# Altium schematic sheet Motor_Driver_Schematic_RevA.SchDoc
size A; SheetNumber: 1; SheetTotal: 1
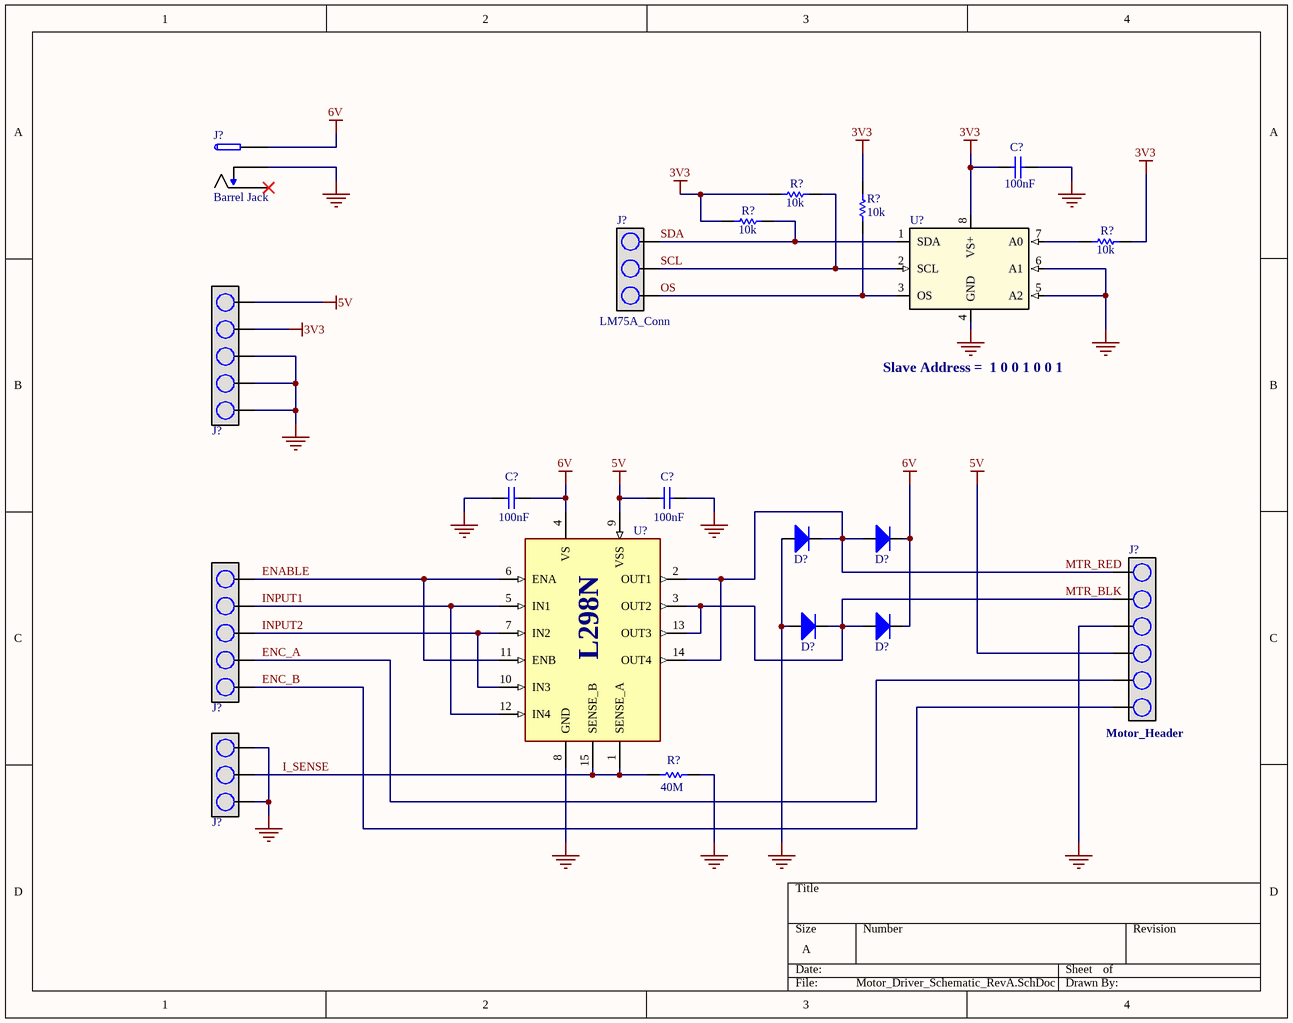
[diagram p0: Motor_Driver_Schematic_RevA.SchDoc]

## Parts
(Parts that share a designator on the sheet are numbered #1, #2 ... from top to bottom, then left to right.)
C?#1  Capacitance: 100nF  [CAP_1206]  (hidden comment: C1206C104K5RAC7800)
C?#2  Capacitance: 100nF  [CAP_1206]  (hidden comment: C1206C104K5RAC7800)
C?#3  Capacitance: 100nF  [CAP_1206]  (hidden comment: C1206C104K5RAC7800)
D?#1  RS2AA R3G  [RS2AA]  (value not drawn)
D?#2  RS2AA R3G  [RS2AA]  (value not drawn)
D?#3  RS2AA R3G  [RS2AA]  (value not drawn)
D?#4  RS2AA R3G  [RS2AA]  (value not drawn)
J?#1  Barrel Jack  [GRAVITECH_CON-SOCJ-2155]
J?#2  5 Pin 2.5mm Male Connector  (value not drawn)
J?#3  LM75A_Conn
J?#4  5 Pin 2.5mm Male Connector  (value not drawn)
J?#5  Motor_Header
J?#6  3 Pin 2.54mm Male Connector  (value not drawn)
R?#1  value 10k  [RES_1206]  (hidden comment: RC1206JR-0710KL)
R?#2  value 10k  [RES_1206]  (hidden comment: RC1206JR-0710KL)
R?#3  value 10k  [RES_1206]  (hidden comment: RC1206JR-0710KL)
R?#4  value 10k  [RES_1206]  (hidden comment: RC1206JR-0710KL)
R?#5  value 40M  [RES_1206]  (hidden comment: RL1206FR-070R04L)
U?#1  LM75AIMXNOPB  [SOIC8]  (value not drawn)
U?#2  L298N  [L298N]

## Nets
3V3: C?#1.2 J?#2.4 R?#1.1 R?#2.1 R?#3.2 R?#4.2 U?#1.8(VS+)
5V: C?#3.1 J?#2.5 J?#5.4 U?#2.9(VSS)
6V: C?#2.2 D?#2.1(K) D?#4.1(K) J?#1.1(POS) U?#2.4(VS)
GND: C?#1.1 C?#2.1 C?#3.2 D?#1.2(A) D?#3.2(A) J?#1.2(NEG) J?#2.1 J?#2.2 J?#2.3 J?#5.3 J?#6.1 J?#6.3 R?#5.1 U?#1.4(GND) U?#1.5(A2) U?#1.6(A1) U?#2.8(GND)
ENABLE: J?#4.5 U?#2.6(ENA) U?#2.11(ENB)
ENC_A: J?#4.2 J?#5.5
ENC_B: J?#4.1 J?#5.6
I_SENSE: J?#6.2 R?#5.2 U?#2.1(SENSE_A) U?#2.15(SENSE_B)
INPUT1: J?#4.4 U?#2.5(IN1) U?#2.12(IN4)
INPUT2: J?#4.3 U?#2.7(IN2) U?#2.10(IN3)
MTR_BLK: D?#3.1(K) D?#4.2(A) J?#5.2 U?#2.3(OUT2) U?#2.13(OUT3)
MTR_RED: D?#1.1(K) D?#2.2(A) J?#5.1 U?#2.2(OUT1) U?#2.14(OUT4)
OS: J?#3.1 R?#3.1 U?#1.3(OS)
SCL: J?#3.2 R?#1.2 U?#1.2(SCL)
SDA: J?#3.3 R?#2.2 U?#1.1(SDA)
NetR?#4_1: R?#4.1 U?#1.7(A0)

Not connected (* = marked no-connect by the designer): J?#1 3(SW)*

## Notes on the sheet
- (near U?#1) Slave Address =  1 0 0 1 0 0 1

## Library data of the parts
C?#1-C?#3 = C1206C104K5RAC7800: 0.1 µF ±10% 50V Ceramic Capacitor X7R 1206 (3216 Metric)
D?#1-D?#4 = RS2AA R3G: Diode Fast Recovery Rectifier 50V 1.5A 2-Pin DO-214AC Plastic T/R; Manufacturer: Taiwan Semiconductor; Supplier: Digikey; Supplier Part Number: RS2AAR3GCT-ND; Manufacturer Part Number: RS2AA R3G; RoHS: Yes; Stock: 3391; Pricing: 1=0.55, 10=0.365, 100=0.2482, 500=0.1944 (USD); RoHS Compliant: Yes; ComponentLink1URL: https://www.taiwansemi.com/products/datasheet/RS2AA%20SERIES_G14.pdf?src-supplier=Digikey; ComponentLink1Description: https://www.taiwansemi.com/products/datasheet/RS2AA%20SERIES_G14.pdf?src-supplier=Digikey
J?#5 = 2.54mm Male Connector
R?#1-R?#4 = RC1206JR-0710KL: Res Thick Film 1206 10K Ohm 5% 1/4W |100ppm/|C SMD Paper T/R; Manufacturer: Yageo; Temperature Coefficient: 100ppm/°C; Power Rating: 250mW; Voltage Rating: 200V; Supplier: Future Electronics; Supplier Part Number: 4750733; Manufacturer Part Number: RC1206JR-0710KL; RoHS: Yes; Category: Chip SMD Resistors; Stock: 4695000; Pricing: 5000=0.0032, 20000=0.003, 75000=0.0029, 150000=0.0028, 375000=0.0027 (USD); Case/Package: 1206; Case Code (Imperial): 1206; Case Code (Metric): 3216; Min Operating Temperature: -55°C; Max Operating Temperature: 155°C; Resistor Type: Thick Film; Tolerance: 5%; Packaging: Cut Tape; Package Quantity: 1; Termination: SMD/SMT; Number of Terminations: 2; Max Power Dissipation: 250mW; Series: RC1206; Resistance Tolerance: 5%; Length: 0.122inch; Width: 0.063inch; Height: 0.026inch; Lead Free: Lead Free; Reach SVHC Compliant: Unknown; RoHS Compliant: Yes; ComponentLink1URL: https://datasheet.ciiva.com/29154/402664-da-01-en-smd-widerstand-chip1206-10-kohm-29154546.pdf?src-supplier=Conrad; ComponentLink1Description: https://datasheet.ciiva.com/29154/402664-da-01-en-smd-widerstand-chip1206-10-kohm-29154546.pdf?src-supplier=Conrad; ComponentLink2URL: https://datasheet.ciiva.com/2458/pyu-rc1206-51-rohs-l-4-2458635.pdf?src-supplier=Digikey; ComponentLink2Description: https://datasheet.ciiva.com/2458/pyu-rc1206-51-rohs-l-4-2458635.pdf?src-supplier=Digikey; ComponentLink3URL: https://datasheet.ciiva.com/2458/pyu-rc1206-51-rohs-l-4-2458636.pdf?src-supplier=Digikey; ComponentLink3Description: https://datasheet.ciiva.com/2458/pyu-rc1206-51-rohs-l-4-2458636.pdf?src-supplier=Digikey; ComponentLink4URL: https://datasheet.ciiva.com/2458/pyu-rc1206-51-rohs-l-4-2458637.pdf?src-supplier=Digikey; ComponentLink4Description: https://datasheet.ciiva.com/2458/pyu-rc1206-51-rohs-l-4-2458637.pdf?src-supplier=Digikey; ComponentLink5URL: https://datasheet.ciiva.com/7983/444357-7983813.pdf?src-supplier=Element14; ComponentLink5Description: https://datasheet.ciiva.com/7983/444357-7983813.pdf?src-supplier=Element14
R?#5 = RL1206FR-070R04L: SMD Current Sense Resistor, 40 Milliohms, ± 1%, 250 mW, 1206 [3216 Metric], Thick Film; Manufacturer: Yageo; Power Rating: 250mW; Temperature Coefficient: 1200ppm/°C; Supplier: Digikey; Supplier Part Number: 311-.04LWCT-ND; Manufacturer Part Number: RL1206FR-070R04L; RoHS: Yes; Category: Chip SMD Resistors; Stock: 18033; Pricing: 1=0.52, 10=0.166, 50=0.1484, 100=0.1306, 1000=0.12757 (USD); Case/Package: 1206; Case Code (Imperial): 1206; Case Code (Metric): 3216; Weight: 0.000571oz; Min Operating Temperature: -55°C; Max Operating Temperature: 155°C; Tolerance: 1%; Packaging: Tape and Reel; Termination: SMD/SMT; Resistor Type: Thick Film; Package Quantity: 5000; Features: Moisture Resistant,Automotive AEC-Q200; Series: RL; Max Power Dissipation: 250mW; Number of Terminations: 2; Technology: THICK FILM; Length: 3.1mm; Width: 1.6mm; Height: 0.55mm; Ratings: AEC-Q200; Lead Free: Lead Free; RoHS Compliant: Yes; ComponentLink1URL: https://datasheet.ciiva.com/15328/pyu-rl-521-rohs-l-5-15328860.pdf?src-supplier=Mouser; ComponentLink1Description: https://datasheet.ciiva.com/15328/pyu-rl-521-rohs-l-5-15328860.pdf?src-supplier=Mouser
U?#1 = LM75AIMXNOPB: No Description Available; Mfr_Name: Texas Instruments; RefDes: RefDes; Type: Type
U?#2 = L298N: Dual Full Bridge Motor Driver 15-Pin(15+Tab) MULTIWATT V Tube; MP: L298N; Availability: Unavailable; Package: None; Value: *; Price: None